# Altium project Project-2S5_AutoEthConv.PrjPcb (part 2 of 2)

## Sheet 03-MCU_INTERFACE.SchDoc
size A3
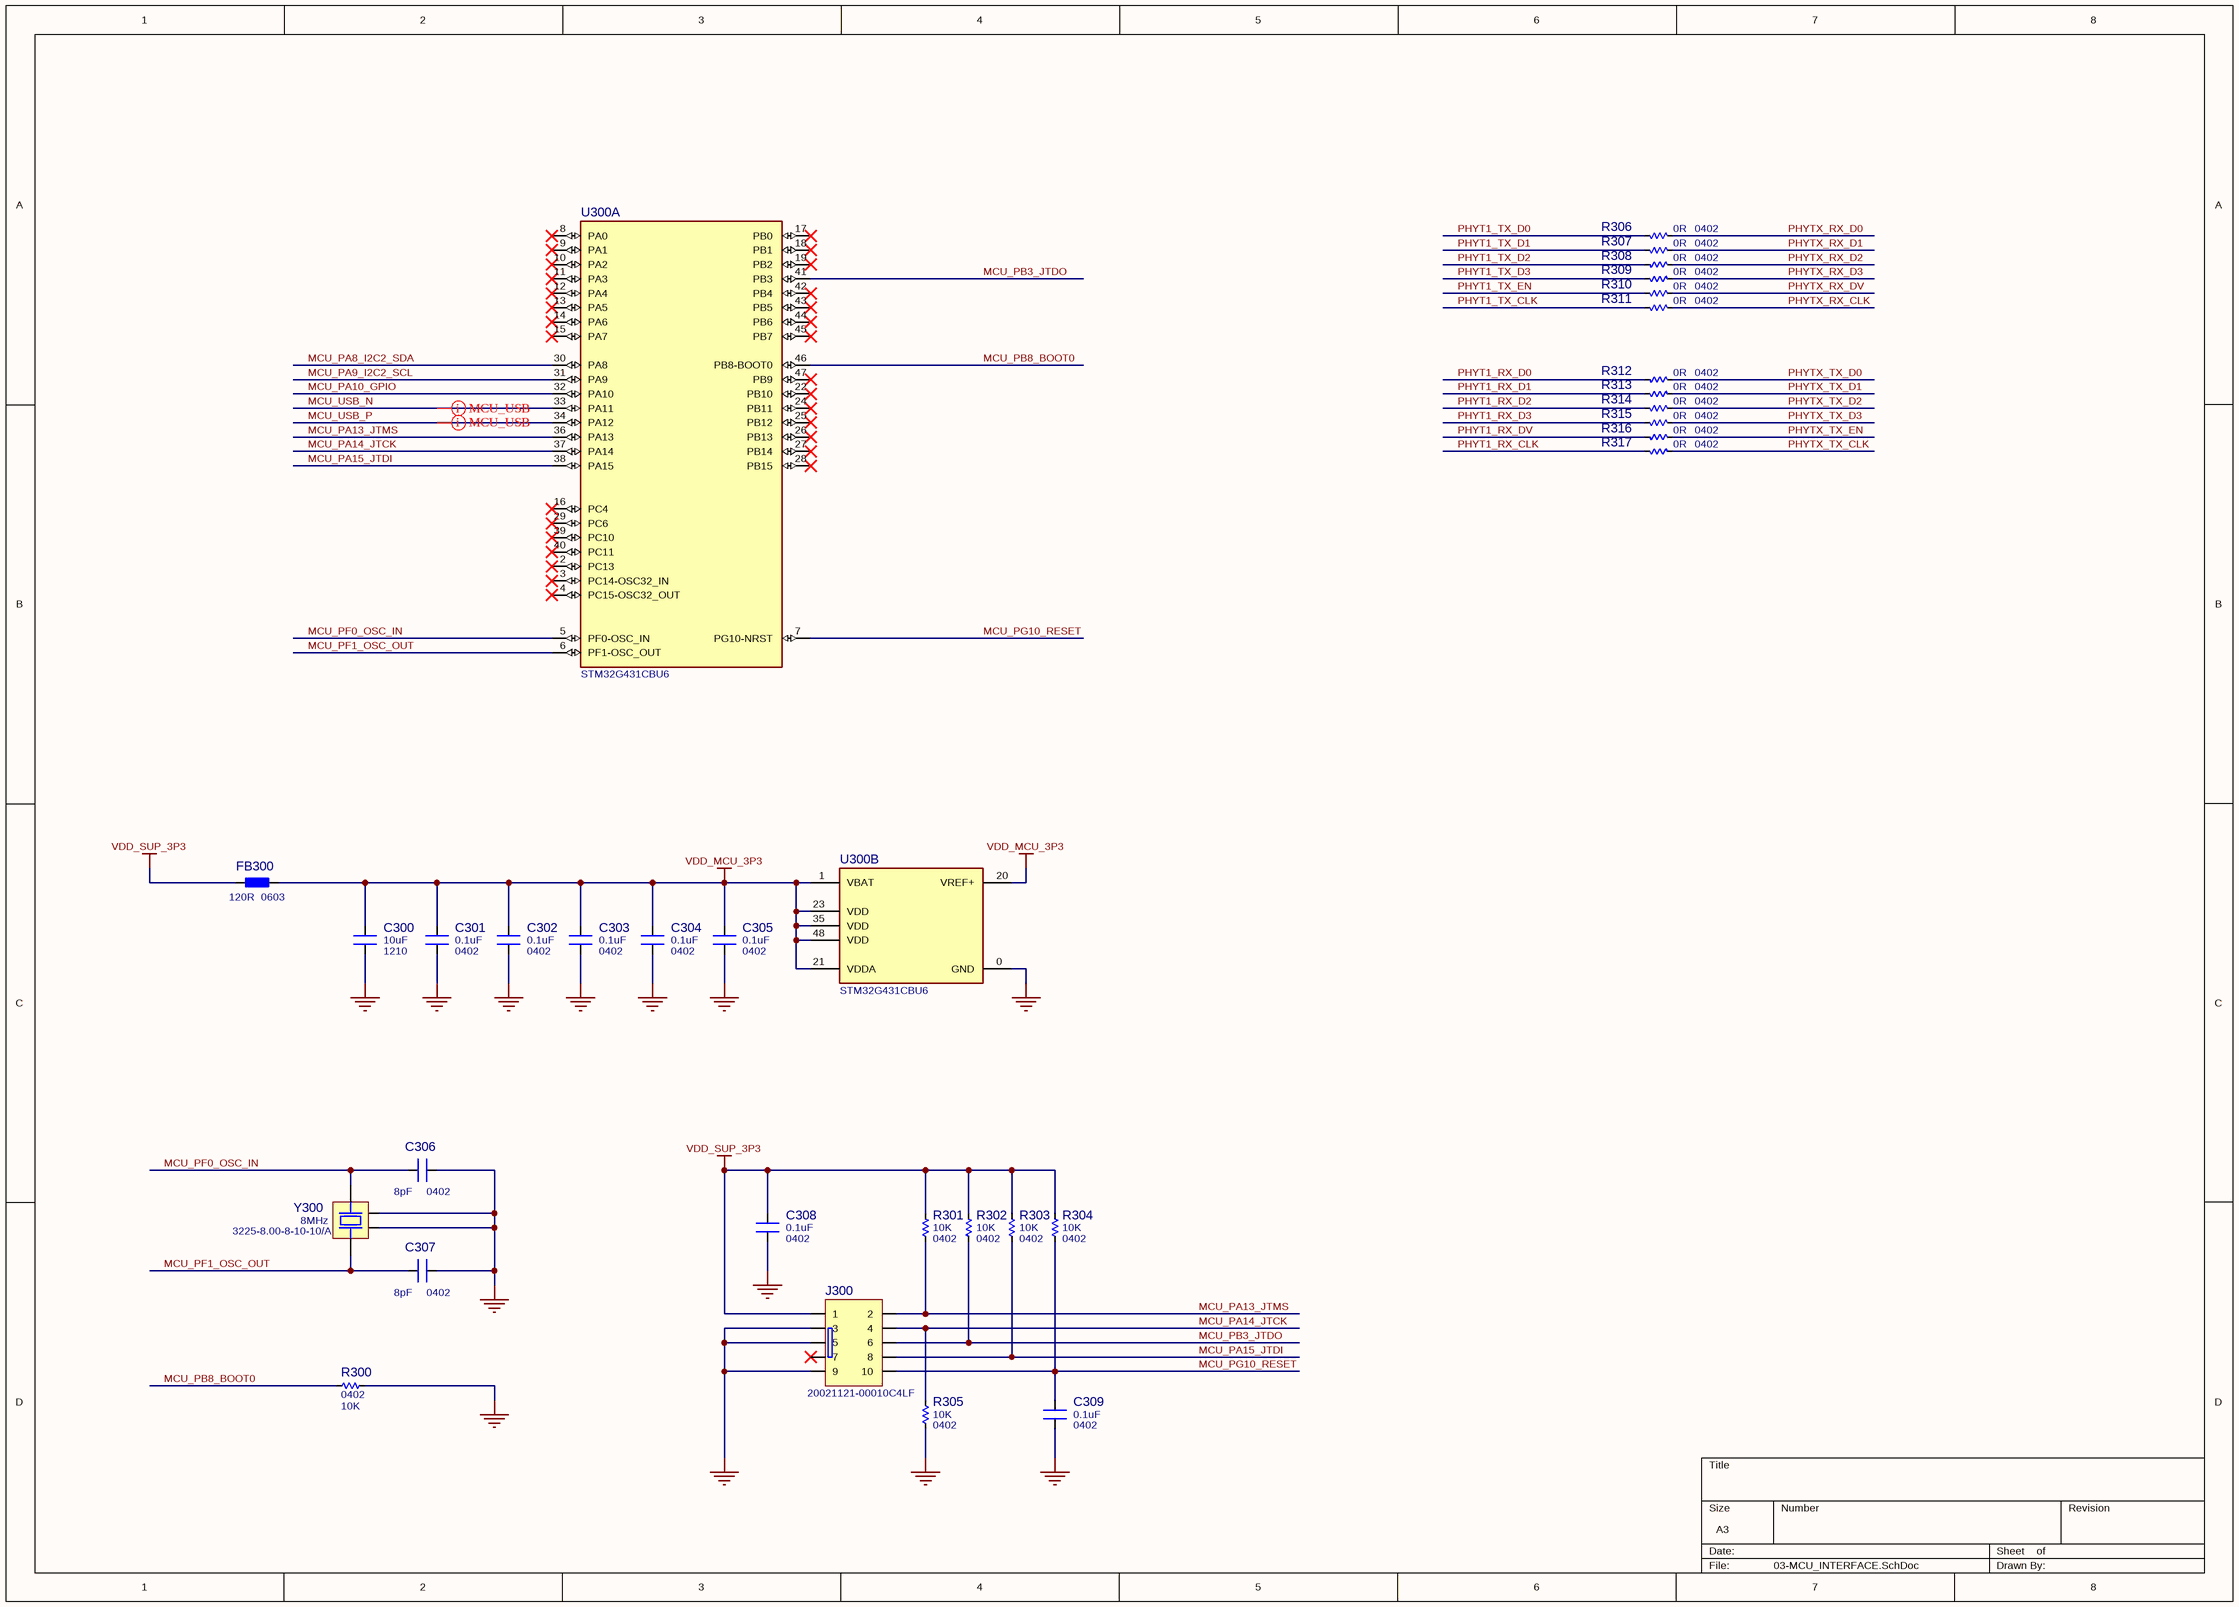
[diagram p2: 03-MCU_INTERFACE.SchDoc]

### Parts
C300  value 10uF  Package: 1210  [CAP_C_1210]  (hidden comment: Capacitor NP)
C301  value 0.1uF  Package: 0402  [CAP_C_0402]  (hidden comment: Capacitor NP)
C302  value 0.1uF  Package: 0402  [CAP_C_0402]  (hidden comment: Capacitor NP)
C303  value 0.1uF  Package: 0402  [CAP_C_0402]  (hidden comment: Capacitor NP)
C304  value 0.1uF  Package: 0402  [CAP_C_0402]  (hidden comment: Capacitor NP)
C305  value 0.1uF  Package: 0402  [CAP_C_0402]  (hidden comment: Capacitor NP)
C306  value 8pF  Package: 0402  [CAP_C_0402]  (hidden comment: Capacitor NP)
C307  value 8pF  Package: 0402  [CAP_C_0402]  (hidden comment: Capacitor NP)
C308  value 0.1uF  Package: 0402  [CAP_C_0402]  (hidden comment: Capacitor NP)
C309  value 0.1uF  Package: 0402  [CAP_C_0402]  (hidden comment: Capacitor NP)
FB300  value 120R  Package: 0603  [IND_C_0603]  (hidden comment: Ferrite bead)
J300  Manufacturer Part Number: 20021121-00010C4LF  [IDE_1.27-SMD-10V_2]  (hidden comment: IDE_10P)
R300  value 10K  Package: 0402  [RES_C_0402]  (hidden comment: Resistor)
R301  value 10K  Package: 0402  [RES_C_0402]  (hidden comment: Resistor)
R302  value 10K  Package: 0402  [RES_C_0402]  (hidden comment: Resistor)
R303  value 10K  Package: 0402  [RES_C_0402]  (hidden comment: Resistor)
R304  value 10K  Package: 0402  [RES_C_0402]  (hidden comment: Resistor)
R305  value 10K  Package: 0402  [RES_C_0402]  (hidden comment: Resistor)
R306  value 0R  Package: 0402  [RES_C_0402]  (hidden comment: Resistor)
R307  value 0R  Package: 0402  [RES_C_0402]  (hidden comment: Resistor)
R308  value 0R  Package: 0402  [RES_C_0402]  (hidden comment: Resistor)
R309  value 0R  Package: 0402  [RES_C_0402]  (hidden comment: Resistor)
R310  value 0R  Package: 0402  [RES_C_0402]  (hidden comment: Resistor)
R311  value 0R  Package: 0402  [RES_C_0402]  (hidden comment: Resistor)
R312  value 0R  Package: 0402  [RES_C_0402]  (hidden comment: Resistor)
R313  value 0R  Package: 0402  [RES_C_0402]  (hidden comment: Resistor)
R314  value 0R  Package: 0402  [RES_C_0402]  (hidden comment: Resistor)
R315  value 0R  Package: 0402  [RES_C_0402]  (hidden comment: Resistor)
R316  value 0R  Package: 0402  [RES_C_0402]  (hidden comment: Resistor)
R317  value 0R  Package: 0402  [RES_C_0402]  (hidden comment: Resistor)
U300  STM32G431CBU6  [QFN50P700X700X100_HS-49N]  (parts A,B of 2)
Y300  Manufacturer Part Number: 3225-8.00-8-10-10/A  Frequency: 8MHz  [XT-SMD-3225-4P]  (hidden comment: Crystal)

### Nets
GND: C300.1 C301.1 C302.1 C303.1 C304.1 C305.1 C306.1 C307.1 C308.1 C309.1 J300.3 J300.5 J300.9 R300.2 R305.2 U300.0(GND) Y300.2 Y300.4
VDD_MCU_3P3: C300.2 C301.2 C302.2 C303.2 C304.2 C305.2 FB300.1 U300.1(VBAT) U300.20(VREF+) U300.21(VDDA) U300.23(VDD) U300.35(VDD) U300.48(VDD)
VDD_SUP_3P3: C308.2 FB300.2 J300.1 R301.1 R302.1 R303.1 R304.1
MCU_PA8_I2C2_SDA: U300.30(PA8)
MCU_PA9_I2C2_SCL: U300.31(PA9)
MCU_PA10_GPIO: U300.32(PA10)
MCU_PA13_JTMS: J300.2 R301.2 U300.36(PA13)
MCU_PA14_JTCK: J300.4 R305.1 U300.37(PA14)
MCU_PA15_JTDI: J300.8 R303.2 U300.38(PA15)
MCU_PB3_JTDO: J300.6 R302.2 U300.41(PB3)
MCU_PB8_BOOT0: R300.1 U300.46(PB8-BOOT0)
MCU_PF0_OSC_IN: C306.2 U300.5(PF0-OSC_IN) Y300.1
MCU_PF1_OSC_OUT: C307.2 U300.6(PF1-OSC_OUT) Y300.3
MCU_PG10_RESET: C309.2 J300.10 R304.2 U300.7(PG10-NRST)
MCU_USB_N: U300.33(PA11)
MCU_USB_P: U300.34(PA12)
PHYT1_RX_CLK: R317.2
PHYT1_RX_D0: R312.2
PHYT1_RX_D1: R313.2
PHYT1_RX_D2: R314.2
PHYT1_RX_D3: R315.2
PHYT1_RX_DV: R316.2
PHYT1_TX_CLK: R311.2
PHYT1_TX_D0: R306.2
PHYT1_TX_D1: R307.2
PHYT1_TX_D2: R308.2
PHYT1_TX_D3: R309.2
PHYT1_TX_EN: R310.2
PHYTX_RX_CLK: R311.1
PHYTX_RX_D0: R306.1
PHYTX_RX_D1: R307.1
PHYTX_RX_D2: R308.1
PHYTX_RX_D3: R309.1
PHYTX_RX_DV: R310.1
PHYTX_TX_CLK: R317.1
PHYTX_TX_D0: R312.1
PHYTX_TX_D1: R313.1
PHYTX_TX_D2: R314.1
PHYTX_TX_D3: R315.1
PHYTX_TX_EN: R316.1

Not connected (* = marked no-connect by the designer): J300 7*; U300 2(PC13)* 3(PC14-OSC32_IN)* 4(PC15-OSC32_OUT)* 8(PA0)* 9(PA1)* 10(PA2)* 11(PA3)* 12(PA4)* 13(PA5)* 14(PA6)* 15(PA7)* 16(PC4)* 17(PB0)* 18(PB1)* 19(PB2)* 22(PB10)* 24(PB11)* 25(PB12)* 26(PB13)* 27(PB14)* 28(PB15)* 29(PC6)* 39(PC10)* 40(PC11)* 42(PB4)* 43(PB5)* 44(PB6)* 45(PB7)* 47(PB9)*

### Layout directives
differential pair; net class NC_DIFFPAIR_90R_USB; differential pair class DIFFPAIR_90R_USB: MCU_USB_N, MCU_USB_P

### Library data of the parts
C300 = Cap: Ceramic Capacitor SMD 1210 10uF ±10% 25V; Manufacturer: Samsung; Manufacturer Part Number: CL32B106KAJNNNE; Temperature Coeffcient: -55 to 85℃; Revision: 0; Tolerance: ±10%; ComponentLink1URL: http://product.samsungsem.com/mlcc/CL05A105KA5NQN.do; ComponentLink1Description: SVN Datasheet; ComponentLink2URL: *; ComponentLink2Description: Local Datasheet; ComponentLink3URL: D:\Altium\Library\AS50 library\AS50.SchLib; ComponentLink3Description: Open Symbol; ComponentLink4URL: D:\Altium\Library\AS50 library\Capacitors.PcbLib; ComponentLink4Description: Open Footprint; ComponentLink5Description: Open Footprint 2; ComponentLink6Description: Open Footprint 3; ComponentLink7Description: Open Footprint 4; Category: Capacitor; Voltage: 25V; Supplier 1: LCSC; Supplier Part Number 1: C39232
C301-C305 C308 C309 = Cap: Ceramic Capacitor SMD 0402 100nF ±10% 16V; Manufacturer: Samsung; Manufacturer Part Number: CL05B104KO5NNNC; Temperature Coeffcient: -55 to 85℃; Revision: 0; Tolerance: ±10%; ComponentLink1URL: http://product.samsungsem.com/mlcc/CL05B104KO5NNN.do; ComponentLink1Description: SVN Datasheet; ComponentLink2URL: *; ComponentLink2Description: Local Datasheet; ComponentLink3URL: D:\Altium\Library\AS50 library\AS50.SchLib; ComponentLink3Description: Open Symbol; ComponentLink4URL: D:\Altium\Library\AS50 library\Capacitors.PcbLib; ComponentLink4Description: Open Footprint; ComponentLink5Description: Open Footprint 2; ComponentLink6Description: Open Footprint 3; ComponentLink7Description: Open Footprint 4; Category: Capacitor; Voltage: 16V; Supplier 1: LCSC; Supplier Part Number 1: C1525
C306 C307 = Cap: Ceramic Capacitor SMD 0402 8pF ±0.25pF 50V; Manufacturer: Yageo; Manufacturer Part Number: CC0402CRNPO9BN8R0; Temperature Coeffcient: -55 to 85℃; Revision: 0; Tolerance: ±0.25pF; ComponentLink1URL: https://www.yageo.com/upload/media/product/products/datasheet/mlcc/UPY-GP_NP0_16V-to-50V_18.pdf; ComponentLink1Description: SVN Datasheet; ComponentLink2URL: *; ComponentLink2Description: Local Datasheet; ComponentLink3URL: D:\Altium\Library\AS50 library\AS50.SchLib; ComponentLink3Description: Open Symbol; ComponentLink4URL: D:\Altium\Library\AS50 library\Capacitors.PcbLib; ComponentLink4Description: Open Footprint; ComponentLink5Description: Open Footprint 2; ComponentLink6Description: Open Footprint 3; ComponentLink7Description: Open Footprint 4; Category: Capacitor; Voltage: 50V; Supplier 1: LCSC; Supplier Part Number 1: C130118
FB300 = Ferrite bead: Ferrite bead SMD 0603 120Ω ±25% @ 100MHz DCR=0.03Ω 3A; Manufacturer: Murata Electronics; Manufacturer Part Number: BLM18KG121TH1D; Category: Ferrite Bead; Tolerance: 25%; Frequency: 100MHz; DC Current: 3A; ComponentLink1URL: https://www.sunlordinc.com/Download.aspx?file=L1VwbG9hZEZpbGVzL1BERl9DYXQvMjAyMTA5MDcxNDU1NTM2OC5wZGY=&lan=en; ComponentLink1Description: SVN Datasheet; ComponentLink2URL: *; ComponentLink2Description: Local Datasheet; ComponentLink3URL: D:\Altium\Library\AS50 library\AS50.SchLib; ComponentLink3Description: Open Symbol; ComponentLink4URL: D:\Altium\Library\AS50 library\Inductors.PcbLib; ComponentLink4Description: Open Footprint; Supplier 1: LCSC; Supplier Part Number 1: C437404
J300 = IDE_10P: Conn Unshrouded Header HDR 10 POS 1.27mm Solder ST Top Entry SMD Tube; Manufacturer: Amphenol ICC; Category: Headers; ComponentLink1URL: https://cdn.amphenol-cs.com/media/wysiwyg/files/drawing/20021121.pdf; ComponentLink1Description: SVN Datasheet; ComponentLink2URL: *; ComponentLink2Description: Local Datasheet; ComponentLink3URL: D:\Altium\Library\AS50 library\AS50.SchLib; ComponentLink3Description: Open Symbol; ComponentLink4URL: D:\Altium\Library\AS50 library\Terminals.PcbLib; ComponentLink4Description: Open Footprint; Supplier 1: LCSC; Supplier Part Number 1: C150517
R300-R305 = Res: Resistor SMD 0402 10K ±1% 1/16W; Manufacturer: UNI-ROYAL(Uniroyal Elec); Manufacturer Part Number: 0402WGF1002TCE; Voltage: 50V; Temperature Coeffcient: ±100ppm/C; Tolerance: ±1%; Revision: 0; ComponentLink1URL: http://uni-royal.cn/images/userfile/file/1590821906c56505e6d9ab55c7.pdf; ComponentLink1Description: SVN Datasheet; ComponentLink2URL: *; ComponentLink2Description: Local Datasheet; ComponentLink3URL: D:\Altium\Library\AS50 library\AS50.SchLib; ComponentLink3Description: Open Symbol; ComponentLink4URL: D:\Altium\Library\AS50 library\Resistors.PcbLib; ComponentLink4Description: Open Footprint; ComponentLink5Description: Open Footprint 2; ComponentLink6Description: Open Footprint 3; ComponentLink7Description: Open Footprint 4; Operating Temperature: -55C to +155C; Category: Resistor; Power: 1/16W; Supplier 1: LCSC; Supplier Part Number 1: C25744
R306-R317 = Res: Resistor SMD 0402 0R ±1% 1/16W; Manufacturer: UNI-ROYAL(Uniroyal Elec); Manufacturer Part Number: 0402WGF0000TCE; Voltage: 50V; Temperature Coeffcient: ±100ppm/C; Tolerance: ±1%; Revision: 0; ComponentLink1URL: http://uni-royal.cn/images/userfile/file/1590821906c56505e6d9ab55c7.pdf; ComponentLink1Description: SVN Datasheet; ComponentLink2URL: *; ComponentLink2Description: Local Datasheet; ComponentLink3URL: D:\Altium\Library\AS50 library\AS50.SchLib; ComponentLink3Description: Open Symbol; ComponentLink4URL: D:\Altium\Library\AS50 library\Resistors.PcbLib; ComponentLink4Description: Open Footprint; ComponentLink5Description: Open Footprint 2; ComponentLink6Description: Open Footprint 3; ComponentLink7Description: Open Footprint 4; Operating Temperature: -55C to +155C; Category: Resistor; Power: 1/16W; Supplier 1: LCSC; Supplier Part Number 1: C17168
U300 = STM32G431CBU6: Arm® Cortex®-M4 32-bit MCU+FPU, 170 MHz /213 DMIPS, up to 128 KB Flash, 32 KB SRAM, rich analog, math accelerator; Manufacturer: STMicroelectronics; Category: ICs; Manufacturer Part Number: STM32G431CBU6; Supplier 1: Digikey; Supplier Part Number 1: 497-19475-ND
Y300 = CX3225SB12000H0PSTC1: 8MHz SMD Crystal Resonator 8pF ±10ppm ±20ppm -20℃~+70℃ SMD3225-4P; Manufacturer: Suzhou Liming Elec; Supplier 1: LCSC; Category: Crystals; ComponentLink1URL: https://datasheet.lcsc.com/lcsc/2008261838_Suzhou-Liming-Elec-3225-8-00-8-10-10-A_C518135.pdf; ComponentLink1Description: SVD Datasheet; ComponentLink2URL: *; ComponentLink2Description: Local Datasheet; Supplier Part Number 1: C518135; ComponentLink3Description: Open Symbol; ComponentLink3URL: D:\Altium\Library\AS50 library\AS50.SchLib; ComponentLink4Description: Open Footprint; ComponentLink4URL: D:\Altium\Library\AS50 library\Crystals.PcbLib

## Sheet 04-USB_POWER.SchDoc
size A3
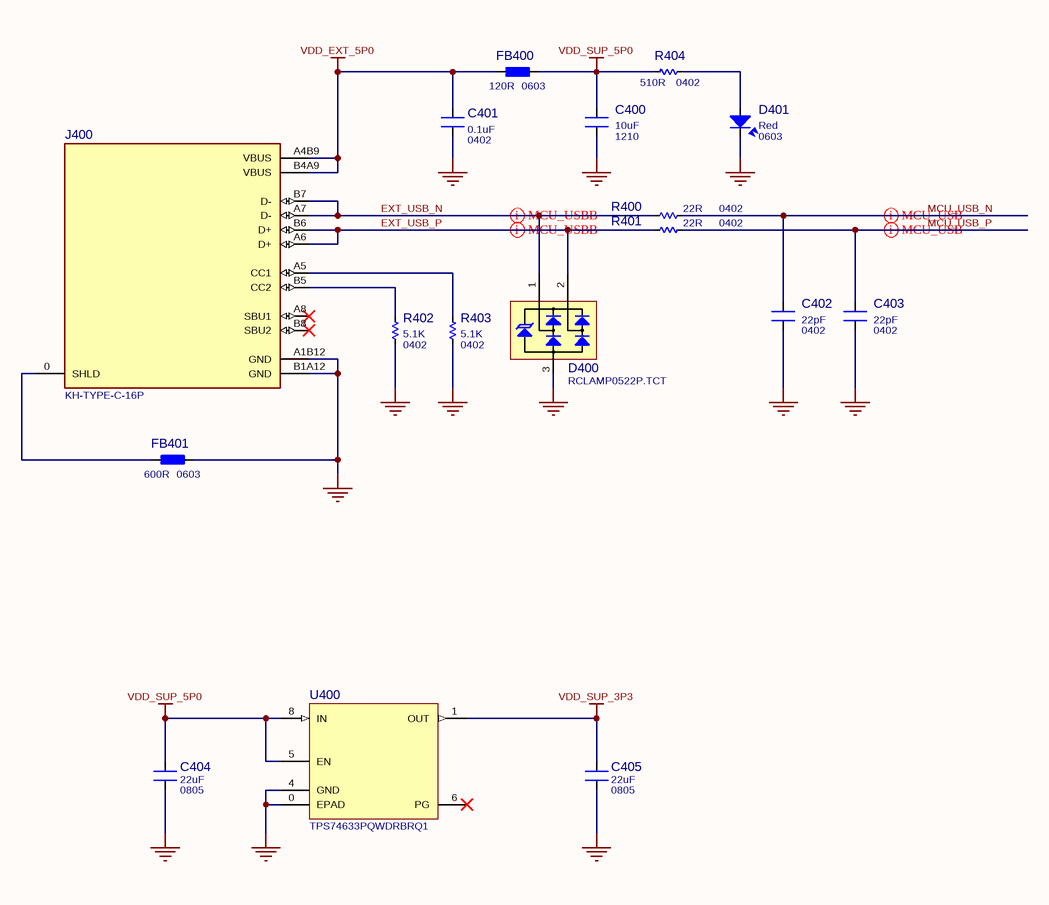
[diagram p3: 04-USB_POWER.SchDoc]

### Parts
C400  value 10uF  Package: 1210  [CAP_C_1210]  (hidden comment: Capacitor NP)
C401  value 0.1uF  Package: 0402  [CAP_C_0402]  (hidden comment: Capacitor NP)
C402  value 22pF  Package: 0402  [CAP_C_0402]  (hidden comment: Capacitor NP)
C403  value 22pF  Package: 0402  [CAP_C_0402]  (hidden comment: Capacitor NP)
C404  value 22uF  Package: 0805  [CAP_C_0805]  (hidden comment: Capacitor NP)
C405  value 22uF  Package: 0805  [CAP_C_0805]  (hidden comment: Capacitor NP)
D400  RCLAMP0522P.TCT  [SLP1610P4]
D401  Color: Red  Package: 0603  [LED-SMD-0603-RED]  (hidden comment: LED)
FB400  value 120R  Package: 0603  [IND_C_0603]  (hidden comment: Ferrite bead)
FB401  value 600R  Package: 0603  [IND_C_0603]  (hidden comment: Ferrite bead)
J400  Manufacturer Part Number: KH-TYPE-C-16P  [USB_C_F_16P_SMD]  (hidden comment: USB_C-16P)
R400  value 22R  Package: 0402  [RES_C_0402]  (hidden comment: Resistor)
R401  value 22R  Package: 0402  [RES_C_0402]  (hidden comment: Resistor)
R402  value 5.1K  Package: 0402  [RES_C_0402]  (hidden comment: Resistor)
R403  value 5.1K  Package: 0402  [RES_C_0402]  (hidden comment: Resistor)
R404  value 510R  Package: 0402  [RES_C_0402]  (hidden comment: Resistor)
U400  TPS74633PQWDRBRQ1  [SON65P300X100_HS-9N]

### Nets
GND: C400.1 C401.1 C402.2 C403.2 C404.1 C405.1 D400.3(GND) D401.2 FB401.1 J400.A1B12(GND) J400.B1A12(GND) R402.2 R403.2 U400.0(EPAD) U400.4(GND)
VDD_EXT_5P0: C401.2 FB400.2 J400.A4B9(VBUS) J400.B4A9(VBUS)
VDD_SUP_3P3: C405.2 U400.1(OUT)
VDD_SUP_5P0: C400.2 C404.2 FB400.1 R404.1 U400.5(EN) U400.8(IN)
EXT_USB_N: D400.1(DM) J400.A7(D-) J400.B7(D-) R400.1
EXT_USB_P: D400.2(DP) J400.A6(D+) J400.B6(D+) R401.1
MCU_USB_N: C402.1 R400.2
MCU_USB_P: C403.1 R401.2
NetD401_1: D401.1 R404.2
NetFB401_2: FB401.2 J400.0(SHLD)
NetJ400_A5: J400.A5(CC1) R403.1
NetJ400_B5: J400.B5(CC2) R402.1

Not connected (* = marked no-connect by the designer): J400 A8(SBU1)* B8(SBU2)*; U400 6(PG)*

### Layout directives
differential pair; net class NC_DIFFPAIR_90R_USB; differential pair class DIFFPAIR_90R_USB: EXT_USB_N, EXT_USB_P, MCU_USB_N, MCU_USB_P

### Library data of the parts
C400 = Cap: as C300 on sheet 03-MCU_INTERFACE; Revision: 0; Tolerance: ±10%; ComponentLink1URL: http://product.samsungsem.com/mlcc/CL05A105KA5NQN.do; ComponentLink1Description: SVN Datasheet; ComponentLink2URL: *; ComponentLink2Description: Local Datasheet; ComponentLink3URL: D:\Altium\Library\AS50 library\AS50.SchLib; ComponentLink3Description: Open Symbol; ComponentLink4URL: D:\Altium\Library\AS50 library\Capacitors.PcbLib; ComponentLink4Description: Open Footprint; ComponentLink5Description: Open Footprint 2; ComponentLink6Description: Open Footprint 3; ComponentLink7Description: Open Footprint 4; Category: Capacitor; Voltage: 25V; Supplier 1: LCSC; Supplier Part Number 1: C39232
C401 = Cap: as C301 on sheet 03-MCU_INTERFACE; Revision: 0; Tolerance: ±10%; ComponentLink1URL: http://product.samsungsem.com/mlcc/CL05B104KO5NNN.do; ComponentLink1Description: SVN Datasheet; ComponentLink2URL: *; ComponentLink2Description: Local Datasheet; ComponentLink3URL: D:\Altium\Library\AS50 library\AS50.SchLib; ComponentLink3Description: Open Symbol; ComponentLink4URL: D:\Altium\Library\AS50 library\Capacitors.PcbLib; ComponentLink4Description: Open Footprint; ComponentLink5Description: Open Footprint 2; ComponentLink6Description: Open Footprint 3; ComponentLink7Description: Open Footprint 4; Category: Capacitor; Voltage: 16V; Supplier 1: LCSC; Supplier Part Number 1: C1525
C402 C403 = Cap: Ceramic Capacitor SMD 0402 22pF ±5% 50V; Manufacturer: FH(Guangdong Fenghua Advanced Tech); Manufacturer Part Number: 0402CG220J500NT; Temperature Coeffcient: -55 to 85℃; Revision: 0; Tolerance: ±5%; ComponentLink1URL: https://datasheet.lcsc.com/lcsc/1810111610_FH-Guangdong-Fenghua-Advanced-Tech-0402CG150J500NT_C1548.pdf; ComponentLink1Description: SVN Datasheet; ComponentLink2URL: *; ComponentLink2Description: Local Datasheet; ComponentLink3URL: D:\Altium\Library\AS50 library\AS50.SchLib; ComponentLink3Description: Open Symbol; ComponentLink4URL: D:\Altium\Library\AS50 library\Capacitors.PcbLib; ComponentLink4Description: Open Footprint; ComponentLink5Description: Open Footprint 2; ComponentLink6Description: Open Footprint 3; ComponentLink7Description: Open Footprint 4; Category: Capacitor; Voltage: 50V; Supplier 1: LCSC; Supplier Part Number 1: C1555
C404 C405 = Cap: Ceramic Capacitor SMD 0805 22uF ±20% 10V; Manufacturer: Samsung; Manufacturer Part Number: CL21A226MPQNNNE; Temperature Coeffcient: -55 to 85℃; Revision: 0; Tolerance: ±20%; ComponentLink1URL: http://product.samsungsem.com/mlcc/CL21A226MPQNNN.do; ComponentLink1Description: SVN Datasheet; ComponentLink2URL: *; ComponentLink2Description: Local Datasheet; ComponentLink3URL: D:\Altium\Library\AS50 library\AS50.SchLib; ComponentLink3Description: Open Symbol; ComponentLink4URL: D:\Altium\Library\AS50 library\Capacitors.PcbLib; ComponentLink4Description: Open Footprint; ComponentLink5Description: Open Footprint 2; ComponentLink6Description: Open Footprint 3; ComponentLink7Description: Open Footprint 4; Category: Capacitor; Voltage: 10V; Supplier 1: LCSC; Supplier Part Number 1: C29277
D400 = RCLAMP0522P.TCT: 15V Clamp 5A (8/20µs) Ipp TVS Diode Surface Mount SLP1610P4; Manufacturer: Semtech; Supplier 1: LCSC; Manufacturer Part Number: RCLAMP0522P.TCT; Category: Diodes; ComponentLink1URL: https://semtech.my.salesforce.com/sfc/p/#E0000000JelG/a/440000001MK2/k1amoKEAHshbxcc58ZeFJEDBUGCuP_6DIpLB6XG33.E; ComponentLink1Description: SVD Datasheet; ComponentLink2URL: *; ComponentLink2Description: Local Datasheet; ComponentLink3URL: D:\Altium\Library\AS50 library\AS50.SchLib; ComponentLink3Description: Open Symbol; Supplier Part Number 1: C112169; ComponentLink4Description: Open Footprint; ComponentLink4URL: D:\Altium\Library\AS50 library\Diodes.PcbLib
D401 = LED: Red 615~630nm 1.9~2.2V 0603 Light Emitting Diodes (LED) RoHS; Manufacturer: Hubei KENTO Elec; Manufacturer Part Number: KT-0603R; Category: LEDs; ComponentLink1URL: http://www.led-kento.com/smd-led/0603-smd-led/0603-smd-led-emitting-color-red.html; ComponentLink1Description: SVD Datasheet; ComponentLink2URL: *; ComponentLink2Description: Local Datasheet; ComponentLink3URL: D:\Altium\Library\AS50 library\AS50.SchLib; ComponentLink3Description: Open Symbol; ComponentLink4URL: D:\Altium\Library\AS50 library\LED.PcbLib; ComponentLink4Description: Open Footprint; Supplier 1: LCSC; Supplier Part Number 1: C2286
FB400 = Ferrite bead: as FB300 on sheet 03-MCU_INTERFACE; Category: Ferrite Bead; Tolerance: 25%; Frequency: 100MHz; DC Current: 3A; ComponentLink1URL: https://www.sunlordinc.com/Download.aspx?file=L1VwbG9hZEZpbGVzL1BERl9DYXQvMjAyMTA5MDcxNDU1NTM2OC5wZGY=&lan=en; ComponentLink1Description: SVN Datasheet; ComponentLink2URL: *; ComponentLink2Description: Local Datasheet; ComponentLink3URL: D:\Altium\Library\AS50 library\AS50.SchLib; ComponentLink3Description: Open Symbol; ComponentLink4URL: D:\Altium\Library\AS50 library\Inductors.PcbLib; ComponentLink4Description: Open Footprint; Supplier 1: LCSC; Supplier Part Number 1: C437404
FB401 = Ferrite bead: Ferrite bead SMD 0603 600Ω ±25% @ 100MHz DCR=0.15Ω 1.3A; Manufacturer: Murata Electronics; Manufacturer Part Number: BLM18KG601SN1D; Category: Ferrite Bead; Tolerance: 25%; Frequency: 100MHz; DC Current: 1.3A; ComponentLink1URL: https://www.sunlordinc.com/Download.aspx?file=L1VwbG9hZEZpbGVzL1BERl9DYXQvMjAyMTA5MDcxNDU1NTM2OC5wZGY=&lan=en; ComponentLink1Description: SVN Datasheet; ComponentLink2URL: *; ComponentLink2Description: Local Datasheet; ComponentLink3URL: D:\Altium\Library\AS50 library\AS50.SchLib; ComponentLink3Description: Open Symbol; ComponentLink4URL: D:\Altium\Library\AS50 library\Inductors.PcbLib; ComponentLink4Description: Open Footprint; Supplier 1: LCSC; Supplier Part Number 1: C85833
J400 = USB_C-16P: 3A 16-pin Female -40℃~+85℃ Type-C SMD USB Connectors; Manufacturer: Shenzhen Kinghelm Elec; Category: Connectors; Supplier 1: LCSC; Supplier Part Number 1: C709357; ComponentLink1Description: SVD Datasheet; ComponentLink1URL: https://datasheet.lcsc.com/lcsc/2009111434_Shenzhen-Kinghelm-Elec-KH-TYPE-C-16P_C709357.pdf; ComponentLink2Description: Local Datasheet; ComponentLink2URL: *; ComponentLink3Description: Open Symbol; ComponentLink3URL: D:\Altium\Library\AS50 library\AS50.SchLib; ComponentLink4Description: Open Footprint; ComponentLink4URL: D:\Altium\Library\AS50 library\Connectors.PcbLib
R400 R401 = Res: Resistor SMD 0402 22R ±1% 1/16W; Manufacturer: UNI-ROYAL(Uniroyal Elec); Manufacturer Part Number: 0402WGF220JTCE; Voltage: 50V; Temperature Coeffcient: ±100ppm/C; Tolerance: ±1%; Revision: 0; ComponentLink1URL: http://uni-royal.cn/images/userfile/file/1590821906c56505e6d9ab55c7.pdf; ComponentLink1Description: SVN Datasheet; ComponentLink2URL: *; ComponentLink2Description: Local Datasheet; ComponentLink3URL: D:\Altium\Library\AS50 library\AS50.SchLib; ComponentLink3Description: Open Symbol; ComponentLink4URL: D:\Altium\Library\AS50 library\Resistors.PcbLib; ComponentLink4Description: Open Footprint; ComponentLink5Description: Open Footprint 2; ComponentLink6Description: Open Footprint 3; ComponentLink7Description: Open Footprint 4; Operating Temperature: -55C to +155C; Category: Resistor; Power: 1/16W; Supplier 1: LCSC; Supplier Part Number 1: C25092
R402 R403 = Res: Resistor SMD 0402 5.1K ±1% 1/16W; Manufacturer: UNI-ROYAL(Uniroyal Elec); Manufacturer Part Number: 0402WGF5101TCE; Voltage: 50V; Temperature Coeffcient: ±100ppm/C; Tolerance: ±1%; Revision: 0; ComponentLink1URL: http://uni-royal.cn/images/userfile/file/1590821906c56505e6d9ab55c7.pdf; ComponentLink1Description: SVN Datasheet; ComponentLink2URL: *; ComponentLink2Description: Local Datasheet; ComponentLink3URL: D:\Altium\Library\AS50 library\AS50.SchLib; ComponentLink3Description: Open Symbol; ComponentLink4URL: D:\Altium\Library\AS50 library\Resistors.PcbLib; ComponentLink4Description: Open Footprint; ComponentLink5Description: Open Footprint 2; ComponentLink6Description: Open Footprint 3; ComponentLink7Description: Open Footprint 4; Operating Temperature: -55C to +155C; Category: Resistor; Power: 1/16W; Supplier 1: LCSC; Supplier Part Number 1: C25905
R404 = Res: Resistor SMD 0402 510R ±1% 1/16W; Manufacturer: Yageo; Manufacturer Part Number: RC0402JR-07510RL; Voltage: 50V; Temperature Coeffcient: ±100ppm/C; Tolerance: ±1%; Revision: 0; ComponentLink1URL: https://www.yageo.com/upload/media/product/products/datasheet/rchip/PYu-RC_Group_51_RoHS_L_12.pdf; ComponentLink1Description: SVN Datasheet; ComponentLink2URL: *; ComponentLink2Description: Local Datasheet; ComponentLink3URL: D:\Altium\Library\AS50 library\AS50.SchLib; ComponentLink3Description: Open Symbol; ComponentLink4URL: D:\Altium\Library\AS50 library\Resistors.PcbLib; ComponentLink4Description: Open Footprint; ComponentLink5Description: Open Footprint 2; ComponentLink6Description: Open Footprint 3; ComponentLink7Description: Open Footprint 4; Operating Temperature: -55C to +155C; Category: Resistor; Power: 1/16W; Supplier 1: LCSC; Supplier Part Number 1: C137860
U400 = TPS746xxPQWDRBRQ1: Texas Instruments TPS746-Q1 Automotive, 1-A LDO With Power-Good in Small Wettable Flank WSON / Packages; Category: ICs; Manufacturer: Texas Instruments; Manufacturer Part Number: TPS74633PQWDRBRQ1; Supplier 1: Digikey; Supplier Part Number 1: 296-TPS74633PQWDRBRQ1CT-ND; ComponentLink1Description: SVD Datasheet; ComponentLink1URL: https://www.ti.com/lit/ds/symlink/tps746-q1.pdf; ComponentLink2Description: Local Datasheet; ComponentLink2URL: *; ComponentLink3Description: Open Symbol; ComponentLink3URL: D:\Altium\Library\AS50 library\AS50.SchLib; ComponentLink4Description: Open Footprint; ComponentLink4URL: D:\Altium\Library\AS50 library\IC.PcbLib

## Nets that join several sheets
GND: 01-100BASET1_PHY (29 pins), 02-100BASETX_PHY (29 pins), 03-MCU_INTERFACE (18 pins), 04-USB_POWER (15 pins)
VDD_SUP_3P3: 01-100BASET1_PHY (19 pins), 02-100BASETX_PHY (25 pins), 03-MCU_INTERFACE (7 pins), 04-USB_POWER (C405.2 U400.1)
MCU_PA8_I2C2_SDA: 01-100BASET1_PHY (R100.2), 02-100BASETX_PHY (R200.2), 03-MCU_INTERFACE (U300.30)
MCU_PA9_I2C2_SCL: 01-100BASET1_PHY (R101.2), 02-100BASETX_PHY (R201.2), 03-MCU_INTERFACE (U300.31)
MCU_PA10_GPIO: 01-100BASET1_PHY (R102.2), 02-100BASETX_PHY (R202.2), 03-MCU_INTERFACE (U300.32)
MCU_USB_N: 03-MCU_INTERFACE (U300.33), 04-USB_POWER (C402.1 R400.2)
MCU_USB_P: 03-MCU_INTERFACE (U300.34), 04-USB_POWER (C403.1 R401.2)
PHYT1_RX_CLK: 01-100BASET1_PHY (U100.27), 03-MCU_INTERFACE (R317.2)
PHYT1_RX_D0: 01-100BASET1_PHY (R111.1 R112.1 U100.26), 03-MCU_INTERFACE (R312.2)
PHYT1_RX_D1: 01-100BASET1_PHY (R113.1 R114.1 U100.25), 03-MCU_INTERFACE (R313.2)
PHYT1_RX_D2: 01-100BASET1_PHY (R115.1 R116.1 U100.24), 03-MCU_INTERFACE (R314.2)
PHYT1_RX_D3: 01-100BASET1_PHY (U100.23), 03-MCU_INTERFACE (R315.2)
PHYT1_RX_DV: 01-100BASET1_PHY (R117.1 R118.1 U100.15), 03-MCU_INTERFACE (R316.2)
PHYT1_TX_CLK: 01-100BASET1_PHY (U100.28), 03-MCU_INTERFACE (R311.2)
PHYT1_TX_D0: 01-100BASET1_PHY (U100.33), 03-MCU_INTERFACE (R306.2)
PHYT1_TX_D1: 01-100BASET1_PHY (U100.32), 03-MCU_INTERFACE (R307.2)
PHYT1_TX_D2: 01-100BASET1_PHY (U100.31), 03-MCU_INTERFACE (R308.2)
PHYT1_TX_D3: 01-100BASET1_PHY (U100.30), 03-MCU_INTERFACE (R309.2)
PHYT1_TX_EN: 01-100BASET1_PHY (U100.29), 03-MCU_INTERFACE (R310.2)
PHYTX_RX_CLK: 02-100BASETX_PHY (U200.25), 03-MCU_INTERFACE (R311.1)
PHYTX_RX_D0: 02-100BASETX_PHY (U200.30), 03-MCU_INTERFACE (R306.1)
PHYTX_RX_D1: 02-100BASETX_PHY (U200.31), 03-MCU_INTERFACE (R307.1)
PHYTX_RX_D2: 02-100BASETX_PHY (U200.32), 03-MCU_INTERFACE (R308.1)
PHYTX_RX_D3: 02-100BASETX_PHY (U200.1), 03-MCU_INTERFACE (R309.1)
PHYTX_RX_DV: 02-100BASETX_PHY (R209.1 U200.26), 03-MCU_INTERFACE (R310.1)
PHYTX_TX_CLK: 02-100BASETX_PHY (U200.2), 03-MCU_INTERFACE (R317.1)
PHYTX_TX_D0: 02-100BASETX_PHY (U200.4), 03-MCU_INTERFACE (R312.1)
PHYTX_TX_D1: 02-100BASETX_PHY (U200.5), 03-MCU_INTERFACE (R313.1)
PHYTX_TX_D2: 02-100BASETX_PHY (U200.6), 03-MCU_INTERFACE (R314.1)
PHYTX_TX_D3: 02-100BASETX_PHY (U200.7), 03-MCU_INTERFACE (R315.1)
PHYTX_TX_EN: 02-100BASETX_PHY (U200.3), 03-MCU_INTERFACE (R316.1)